# Altium project Remote_control.PrjPcb
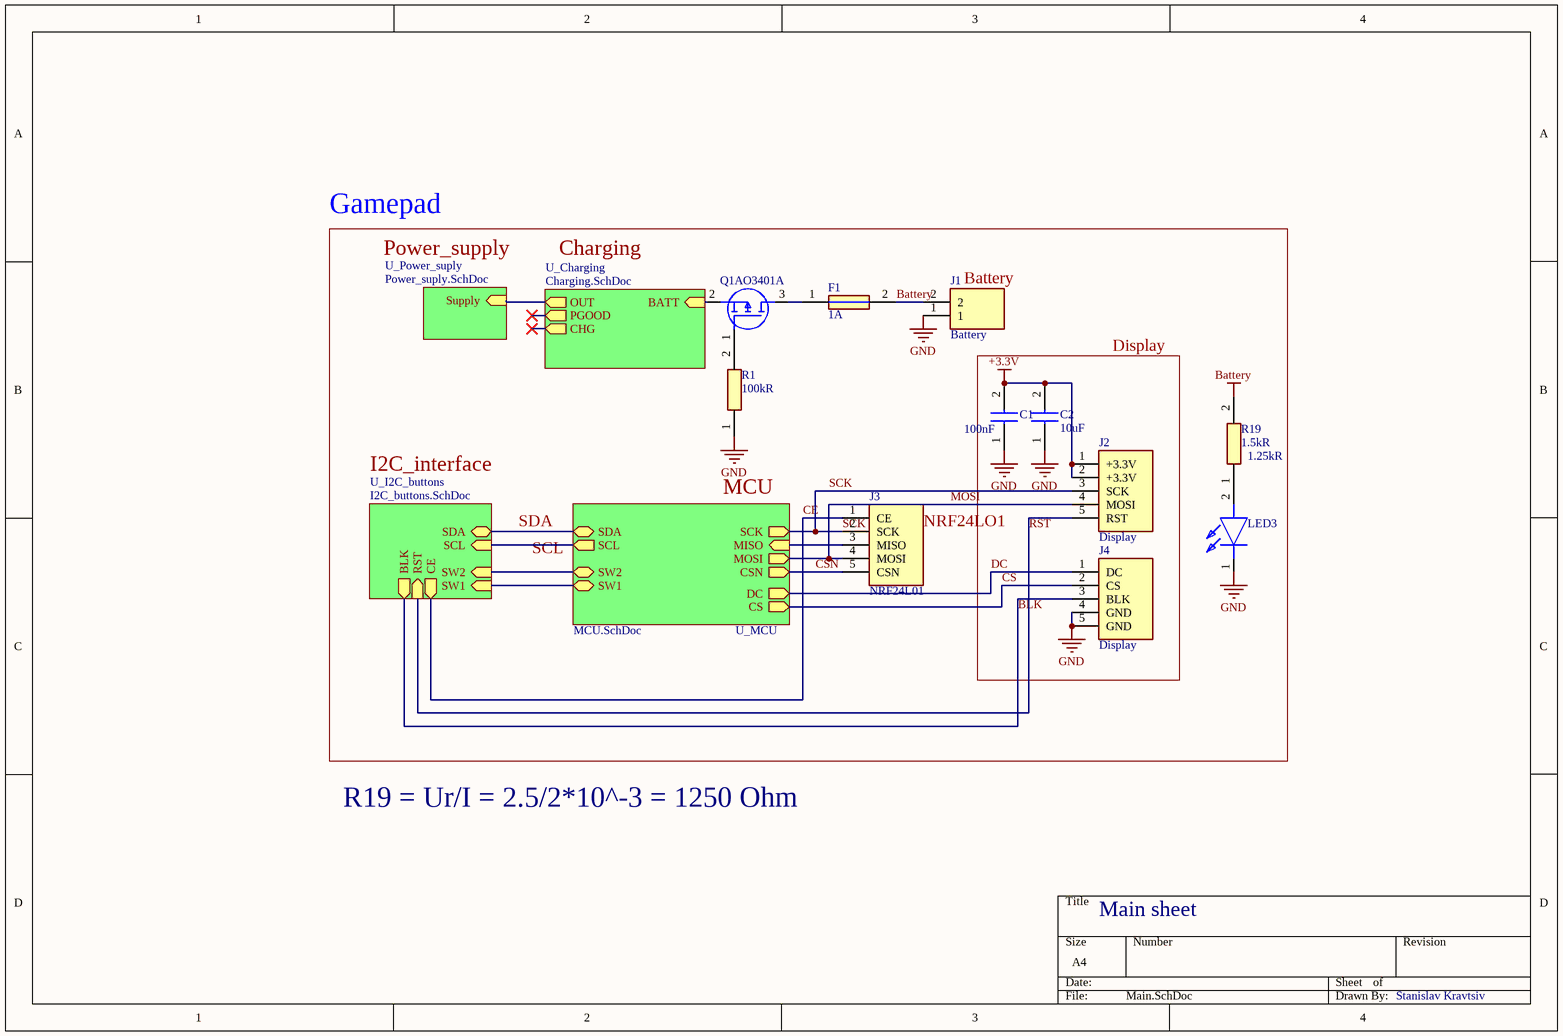
[diagram p0: Main.SchDoc]
5 sheets, 50 parts. Net scope: hierarchical (ports join the sheet entries above them; power ports are global).
Board file: Remote_control_PCB.PcbDoc
Sheets:
  Main.SchDoc
    U_MCU = MCU.SchDoc
    U_I2C_buttons = I2C_buttons.SchDoc
    U_Power_suply = Power_suply.SchDoc
    U_Charging = Charging.SchDoc

## Sheet Main.SchDoc
size A4; SheetNumber: 2; SheetTotal: 6

### Parts
C1  100nF  [CAPC1608X95N]
C2  10uF  [CAPC2012X140N]
F1  1А  [FUSC6125X279N]
J1  Battery  [Conector_2]
J2  Display  [1.25_JSH-GH_5]
J3  NRF24L01  [1.25_JSH-GH_5]
J4  Display  [1.25_JSH-GH_5]
LED3  LS_L29K-H1J2-1  [SMT-0603]  (value not drawn)
Q1  AO3401A  [SOT95P280X125-3N]
R1  100kR  [RESC1608X55N]
R19  1.5kR  [RESC1608X55N]

### Blocks framed on the sheet
Gamepad: F1 J1 J3 LED3 Q1 R1 R19
Display: C1 C2 J2 J4

### Sub-sheets
U_Charging = Charging.SchDoc: BATT (in), OUT (out), PGOOD (out), CHG (out)
U_I2C_buttons = I2C_buttons.SchDoc: CE (out), RST (in), BLK (out), SDA (bidir), SCL (in), SW2 (in), SW1 (in)
U_MCU = MCU.SchDoc: DC (out), CS (out), SDA (bidir), SCL (out), SW2 (bidir), SW1 (bidir), CSN (out), MOSI (out), MISO (in), SCK (out)
U_Power_suply = Power_suply.SchDoc: Supply (in)

### Nets
+3.3V: C1.2 C2.2 J2.1(+3.3V) J2.2(+3.3V)
Battery: F1.2 J1.2 R19.2
GND: C1.1 C2.1 J1.1 J4.4(GND) J4.5(GND) LED3.1(K) R1.1
BATT: Q1.2(S) ; sheet U_Charging/BATT
BLK: J4.3(BLK) ; sheet U_I2C_buttons/BLK
CE: J3.1(CE) ; sheet U_I2C_buttons/CE
CS: J4.2(CS) ; sheet U_MCU/CS
CSN: J3.5(CSN) ; sheet U_MCU/CSN
DC: J4.1(DC) ; sheet U_MCU/DC
MISO: J3.3(MISO) ; sheet U_MCU/MISO
MOSI: J2.4(MOSI) J3.4(MOSI) ; sheet U_MCU/MOSI
OUT: sheet U_Power_suply/Supply, sheet U_Charging/OUT, sheet U_Charging/PGOOD, sheet U_Charging/CHG
RST: J2.5(RST) ; sheet U_I2C_buttons/RST
SCK: J2.3(SCK) J3.2(SCK) ; sheet U_MCU/SCK
SCL: sheet U_MCU/SCL, sheet U_I2C_buttons/SCL
SDA: sheet U_MCU/SDA, sheet U_I2C_buttons/SDA
SW1: sheet U_MCU/SW1, sheet U_I2C_buttons/SW1
SW2: sheet U_MCU/SW2, sheet U_I2C_buttons/SW2
NetF1_1: F1.1 Q1.3(D)
NetLED3_2: LED3.2(A) R19.1
NetQ1_1: Q1.1(G) R1.2

### Notes on the sheet
- Power_supply
- Charging
- (near J1) Battery
- I2C_interface
- MCU
- (near R19) 1.25kR
- SDA
- SCL
- NRF24LO1
- R19 = Ur/I = 2.5/2*10^-3 = 1250 Ohm
- Main sheet
- Stanislav Kravtsiv

### Library data of the parts
C1 = 0603B104K500CT: Capacitor; Manufacturer_Name: Walsin Technology Corporation; Datasheet Link: https://datasheet.datasheetarchive.com/originals/distributors/DKDS41/DSANUWW0027552.pdf; Height: 0.95mm; Manufacturer_Part_Number: 0603B104K500CT; Mouser Part Number: 791-0603B104K500CT; Mouser Price/Stock: https://www.mouser.co.uk/ProductDetail/Walsin/0603B104K500CT?qs=fIkAfuXiAQLxgNQoxkAdgw%3D%3D; Arrow Part Number: 0603B104K500CT; Arrow Price/Stock: https://www.arrow.com/en/products/0603b104k500ct/walsin-technology
C2 = CL21B106KPQNNNG: Capacitor; Manufacturer_Name: SAMSUNG; Datasheet Link: https://datasheet.datasheetarchive.com/originals/distributors/Datasheets-DGA8/2485630.pdf; Height: 1.4mm; Manufacturer_Part_Number: CL21B106KPQNNNG; Mouser Part Number: 187-CL21B106KPQNNNG; Mouser Price/Stock: https://www.mouser.co.uk/ProductDetail/Samsung-Electro-Mechanics/CL21B106KPQNNNG?qs=yOVawPpwOwmi1gAJqK4H6Q%3D%3D; Arrow Part Number: CL21B106KPQNNNG; Arrow Price/Stock: https://www.arrow.com/en/products/cl21b106kpqnnng/samsung-electro-mechanics?utm_currency=USD&region=nac
F1 = 0679L2000-01: Fuse; Manufacturer_Name: BelFuse; Datasheet Link: https://componentsearchengine.com/Datasheets/1/0679L2000-01.pdf; Height: 2.79mm; Manufacturer_Part_Number: 0679L2000-01; Mouser Part Number: 530-0679L2000-01; Mouser Price/Stock: https://www.mouser.co.uk/ProductDetail/Bel-Fuse/0679L2000-01?qs=ZqXcJfGlKsicXrgxMSU%252B%2Fw%3D%3D
J1 = B2B-XH-AM_LF__SN_: Connector; Manufacturer_Name: JST (JAPAN SOLDERLESS TERMINALS); Manufacturer_Part_Number: B2B-XH-AM(LF)(SN); Datasheet Link: https://www.jst-mfg.com/product/pdf/eng/eXH.pdf; Height: 7mm; Mouser Part Number: 306-B2B-XH-AMLFSNP; Mouser Price/Stock: https://www.mouser.co.uk/ProductDetail/JST-Commercial/B2B-XH-AMLFSN?qs=cdbOS8ANM9BJgHgwB7WxQw%3D%3D; Arrow Part Number: B2B-XH-AM(LF)(SN); Arrow Price/Stock: https://www.arrow.com/en/products/b2b-xh-am-lf-sn/jst-manufacturing?utm_currency=USD&region=europe
J2-J4 = B5B-XH-AM__LF__SN_: Connector; Manufacturer_Name: JST (JAPAN SOLDERLESS TERMINALS); Manufacturer_Part_Number: B5B-XH-AM (LF)(SN); Datasheet Link: http://uk.rs-online.com/web/p/products/1755317; Height: 7mm; Arrow Part Number: B5B-XH-AM (LF)(SN); Arrow Price/Stock: https://www.arrow.com/en/products/b5b-xh-am-lf-sn/jst-manufacturing
LED3 = LS_L29K-H1J2-1: LED; Manufacturer_Name: ams OSRAM; Manufacturer_Part_Number: LS L29K-H1J2-1; Mouser Part Number: 720-LSL29K-H1J2-1-Z; Mouser Price/Stock: https://www.mouser.com/Search/Refine.aspx?Keyword=720-LSL29K-H1J2-1-Z
Q1 = AO3401A: MOSFET (P-Channel); Manufacturer_Name: Alpha & Omega Semiconductors; Datasheet Link: http://www.aosmd.com/pdfs/datasheet/AO3401A.pdf; Height: 1.25mm; Manufacturer_Part_Number: AO3401A; Arrow Part Number: AO3401A; Arrow Price/Stock: https://www.arrow.com/en/products/ao3401a/alpha-and-omega-semiconductor.html?utm_currency=USD&region=europe
R1 = RC0603FR-07100KL: Resistor; Manufacturer_Name: YAGEO; Datasheet Link: https://www.yageo.com/upload/media/product/productsearch/datasheet/rchip/PYu-RC_Group_51_RoHS_L_12.pdf; Height: 0.55mm; Manufacturer_Part_Number: RC0603FR-07100KL; Mouser Part Number: 603-RC0603FR-07100KL; Mouser Price/Stock: https://www.mouser.co.uk/ProductDetail/YAGEO/RC0603FR-07100KL?qs=e1ok2LiJcmaihem8Va5%2Fsw%3D%3D; Arrow Part Number: RC0603FR-07100KL; Arrow Price/Stock: https://www.arrow.com/en/products/rc0603fr-07100kl/yageo?utm_currency=USD&region=europe
R19 = RC0603FR-071K5L: Resistor; Manufacturer_Name: Yageo Group; Datasheet Link: https://www.yageo.com/upload/media/product/productsearch/datasheet/rchip/PYu-RC_Group_51_RoHS_L_12.pdf; Height: 0.55mm; Manufacturer_Part_Number: RC0603FR-071K5L; Mouser Part Number: 603-RC0603FR-071K5L; Mouser Price/Stock: https://www.mouser.co.uk/ProductDetail/YAGEO/RC0603FR-071K5L?qs=VU8sRB4EgwBMt9nc4XGNgA%3D%3D; Arrow Part Number: RC0603FR-071K5L; Arrow Price/Stock: https://www.arrow.com/en/products/rc0603fr-071k5l/yageo?utm_currency=USD&region=europe

## Sheet MCU.SchDoc
size A4; SheetNumber: 4; SheetTotal: 6
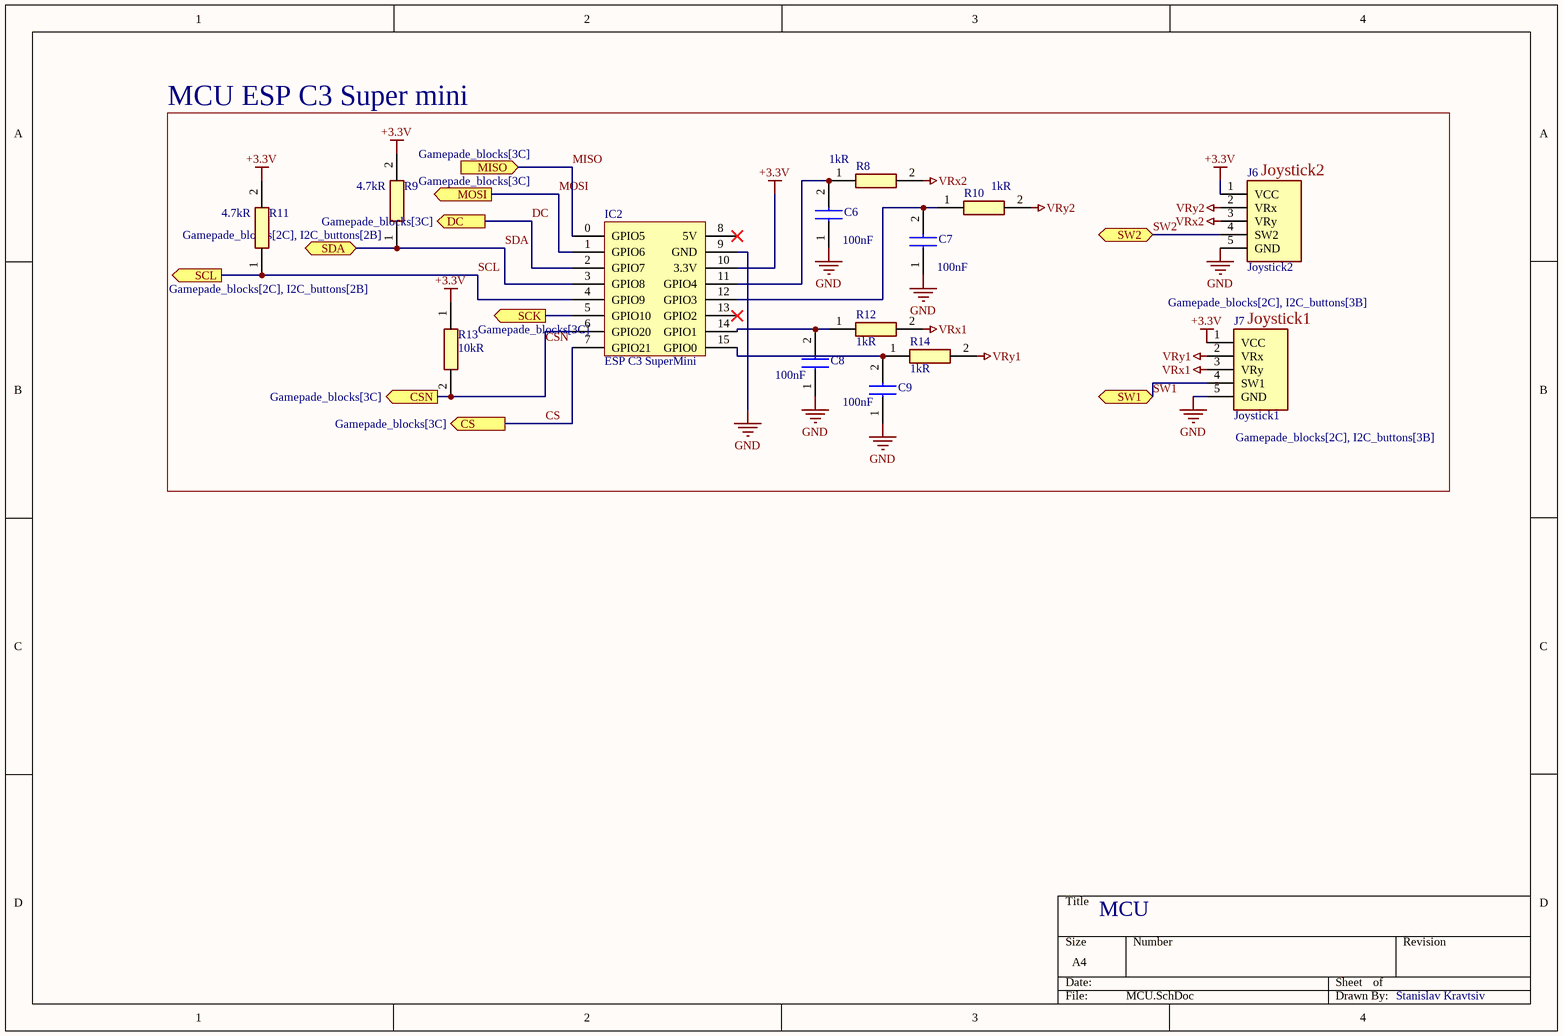
[diagram p1: MCU.SchDoc]

### Parts
C6  100nF  [CAPC1608X95N]
C7  100nF  [CAPC1608X95N]
C8  100nF  [CAPC1608X95N]
C9  100nF  [CAPC1608X95N]
IC2  ESP C3 SuperMini  [esp c3 super mini]
J6  Joystick2  [1.25_JSH-GH_5]
J7  Joystick1  [1.25_JSH-GH_5]
R8  1kR  [RESC1608X55N]
R9  4.7kR  [RESC1608X55N]
R10  1kR  [RESC1608X55N]
R11  4.7kR  [RESC1608X55N]
R12  1kR  [RESC1608X55N]
R13  10kR  [RESC1608X55N]
R14  1kR  [RESC1608X55N]

### Ports
CS (out, see Gamepade_blocks[3C]), CSN (out, see Gamepade_blocks[3C]), DC (out, see Gamepade_blocks[3C]), MISO (in, see Gamepade_blocks[3C]), MOSI (out, see Gamepade_blocks[3C]), SCK (out, see Gamepade_blocks[3C]), SCL (out, see Gamepade_blocks[2C], I2C_buttons[2B]), SDA (bidir, see Gamepade_blocks[2C], I2C_buttons[2B]), SW1 (bidir, see Gamepade_blocks[2C], I2C_buttons[3B]), SW2 (bidir, see Gamepade_blocks[2C], I2C_buttons[3B])

### Nets
+3.3V: IC2.10(3.3V) J6.1(VCC) J7.1(VCC) R9.2 R11.2 R13.1
GND: C6.1 C7.1 C8.1 C9.1 IC2.9(GND) J6.5(GND) J7.5(GND)
VRx1: J7.3(VRy) R12.2
VRx2: J6.3(VRy) R8.2
VRy1: J7.2(VRx) R14.2
VRy2: J6.2(VRx) R10.2
CS: IC2.7(GPIO21) ; port CS
CSN: IC2.6(GPIO20) R13.2 ; port CSN
DC: IC2.2(GPIO7) ; port DC
MISO: IC2.0(GPIO5) ; port MISO
MOSI: IC2.1(GPIO6) ; port MOSI
SCK: IC2.5(GPIO10) ; port SCK
SCL: IC2.4(GPIO9) R11.1 ; port SCL
SDA: IC2.3(GPIO8) R9.1 ; port SDA
SW1: J7.4(SW1) ; port SW1
SW2: J6.4(SW2) ; port SW2
NetC6_2: C6.2 IC2.11(GPIO4) R8.1
NetC7_2: C7.2 IC2.12(GPIO3) R10.1
NetC8_2: C8.2 IC2.14(GPIO1) R12.1
NetC9_2: C9.2 IC2.15(GPIO0) R14.1

Not connected (* = marked no-connect by the designer): IC2 8(5V)* 13(GPIO2)*

### Notes on the sheet
- MCU ESP C3 Super mini
- (near J6) Joystick2
- (near J7) Joystick1
- MCU
- Stanislav Kravtsiv

### Library data of the parts
C6-C9 = 0603B104K500CT: as C1 on sheet Main; Datasheet Link: https://datasheet.datasheetarchive.com/originals/distributors/DKDS41/DSANUWW0027552.pdf; Height: 0.95mm; Manufacturer_Part_Number: 0603B104K500CT; Mouser Part Number: 791-0603B104K500CT; Mouser Price/Stock: https://www.mouser.co.uk/ProductDetail/Walsin/0603B104K500CT?qs=fIkAfuXiAQLxgNQoxkAdgw%3D%3D; Arrow Part Number: 0603B104K500CT; Arrow Price/Stock: https://www.arrow.com/en/products/0603b104k500ct/walsin-technology
IC2 = IC
J6 J7 = B5B-XH-AM__LF__SN_: as J2 on sheet Main; Datasheet Link: http://uk.rs-online.com/web/p/products/1755317; Height: 7mm; Arrow Part Number: B5B-XH-AM (LF)(SN); Arrow Price/Stock: https://www.arrow.com/en/products/b5b-xh-am-lf-sn/jst-manufacturing
R8 R10 R12 R14 = RC0603FR-071KL: Resistor; Manufacturer_Name: Yageo Group; Datasheet Link: https://www.yageo.com/upload/media/product/productsearch/datasheet/rchip/PYu-RC_Group_51_RoHS_L_12.pdf; Height: 0.55mm; Manufacturer_Part_Number: RC0603FR-071KL; Mouser Part Number: 603-RC0603FR-071KL; Mouser Price/Stock: https://www.mouser.co.uk/ProductDetail/YAGEO/RC0603FR-071KL?qs=VU8sRB4EgwApHsk4rF%2F3zg%3D%3D; Arrow Part Number: RC0603FR-071KL; Arrow Price/Stock: https://www.arrow.com/en/products/rc0603fr-071kl/yageo?utm_currency=USD&region=europe
R9 R11 = RC0603FR-074K75L: Resistor; Manufacturer_Name: Yageo Group; Datasheet Link: http://www.yageo.com/documents/recent/PYu-RC0603_51_RoHS_L_v5.pdf; Height: 0.55mm; Manufacturer_Part_Number: RC0603FR-074K75L; Mouser Part Number: 603-RC0603FR-074K75L; Mouser Price/Stock: https://www.mouser.co.uk/ProductDetail/Yageo/RC0603FR-074K75L?qs=5Z1f76oN9PMSImX%2FXUaE6Q%3D%3D; Arrow Part Number: RC0603FR-074K75L; Arrow Price/Stock: https://www.arrow.com/en/products/rc0603fr-074k75l/yageo
R13 = RC0603FR0710KL: Resistor; Manufacturer_Name: Yageo Group; Value: 10kOhm; Datasheet Link: http://www.yageo.com/documents/recent/PYu-RC0603_51_RoHS_L_v5.pdf; Height: 0.55mm; Manufacturer_Part_Number: RC0603FR0710KL; Arrow Part Number: RC0603FR0710KL; Arrow Price/Stock: https://www.arrow.com/en/products/rc0603fr-0710kl/yageo

## Sheet I2C_buttons.SchDoc
size A4; SheetNumber: 6; SheetTotal: 6
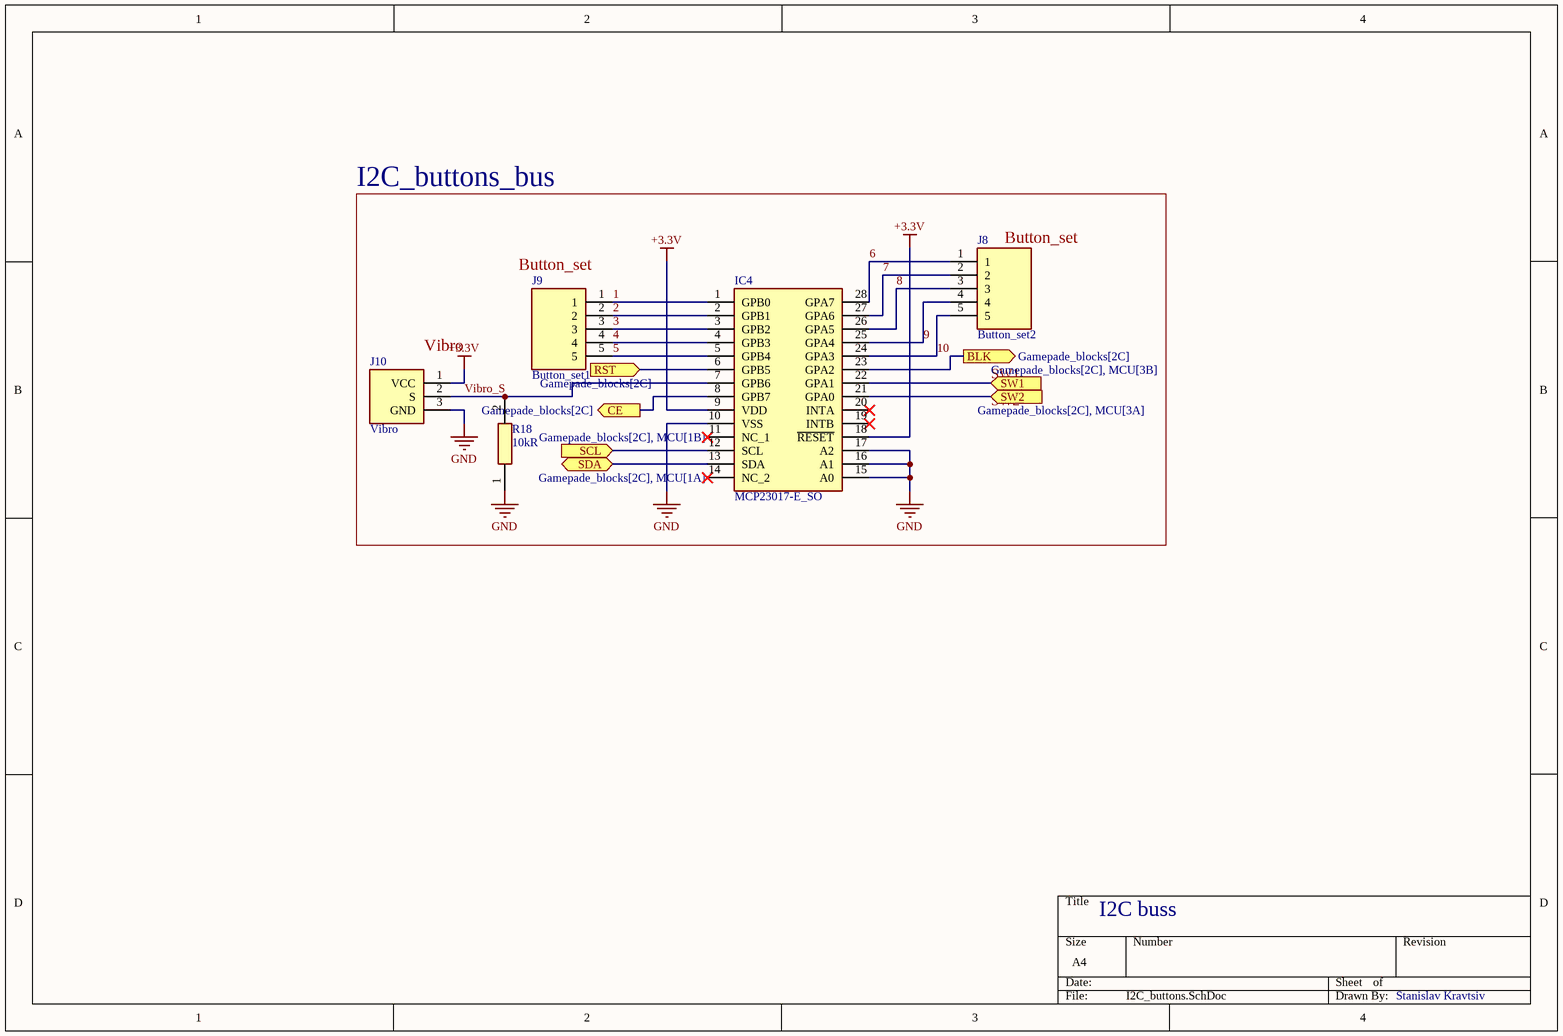
[diagram p2: I2C_buttons.SchDoc]

### Parts
IC4  MCP23017-E_SO  [SOIC127P1030X265-28N]
J8  Button_set2  [1.25_JSH-GH_5]
J9  Button_set1  [1.25_JSH-GH_5]
J10  Vibro  [B3BXHALFSN]
R18  10kR  [RESC1608X55N]

### Ports
BLK (out, see Gamepade_blocks[2C]), CE (out, see Gamepade_blocks[2C]), RST (in, see Gamepade_blocks[2C]), SCL (in, see Gamepade_blocks[2C], MCU[1B]), SDA (bidir, see Gamepade_blocks[2C], MCU[1A]), SW1 (in, see Gamepade_blocks[2C], MCU[3B]), SW2 (in, see Gamepade_blocks[2C], MCU[3A])

### Nets
+3.3V: IC4.9(VDD) IC4.18(~{RESET}) J10.1(VCC)
GND: IC4.10(VSS) IC4.15(A0) IC4.16(A1) IC4.17(A2) J10.3(GND) R18.1
1: IC4.1(GPB0) J9.1
2: IC4.2(GPB1) J9.2
3: IC4.3(GPB2) J9.3
4: IC4.4(GPB3) J9.4
5: IC4.5(GPB4) J9.5
6: IC4.28(GPA7) J8.1
7: IC4.27(GPA6) J8.2
8: IC4.26(GPA5) J8.3
9: IC4.25(GPA4) J8.4
10: IC4.24(GPA3) J8.5
BLK: IC4.23(GPA2) ; port BLK
CE: IC4.8(GPB7) ; port CE
RST: IC4.6(GPB5) ; port RST
SCL: IC4.12(SCL) ; port SCL
SDA: IC4.13(SDA) ; port SDA
SW1: IC4.22(GPA1) ; port SW1
SW2: IC4.21(GPA0) ; port SW2
Vibro_S: IC4.7(GPB6) J10.2(S) R18.2

Not connected (* = marked no-connect by the designer): IC4 11(NC_1)* 14(NC_2)* 19(INTB)* 20(INTA)*

### Notes on the sheet
- I2C_buttons_bus
- (near J8) Button_set
- (near J9) Button_set
- (near J10) Vibro
- (near J8) SW1
- SW2
- I2C buss
- Stanislav Kravtsiv

### Library data of the parts
IC4 = MCP23017-E_SO: Integrated Circuit; Manufacturer_Name: Microchip; Manufacturer_Part_Number: MCP23017-E/SO; Datasheet Link: https://datasheet.datasheetarchive.com/originals/distributors/SFDatasheet-4/sf-00090057.pdf; Height: 2.65mm; Mouser Part Number: 579-MCP23017-E/SO; Mouser Price/Stock: https://www.mouser.co.uk/ProductDetail/Microchip-Technology/MCP23017-E-SO?qs=usxtMOJb1Rz8hft7vV7YMQ%3D%3D; Arrow Part Number: MCP23017-E/SO; Arrow Price/Stock: https://www.arrow.com/en/products/mcp23017-eso/microchip-technology.html?utm_currency=USD&region=europe
J8 J9 = B5B-XH-AM__LF__SN_: as J2 on sheet Main; Datasheet Link: http://uk.rs-online.com/web/p/products/1755317; Height: 7mm; Arrow Part Number: B5B-XH-AM (LF)(SN); Arrow Price/Stock: https://www.arrow.com/en/products/b5b-xh-am-lf-sn/jst-manufacturing
J10 = B3B-XH-A_LF__SN_: Connector; Manufacturer_Name: JST (JAPAN SOLDERLESS TERMINALS); Manufacturer_Part_Number: B3B-XH-A(LF)(SN); Datasheet Link: https://datasheet.lcsc.com/szlcsc/1812131720_JST-Sales-America-B3B-XH-A-LF-SN_C144394.pdf; Height: 7mm; Mouser Part Number: 306-B3BXHALFSNP; Mouser Price/Stock: https://www.mouser.co.uk/ProductDetail/JST-Commercial/B3B-XH-ALFSN?qs=cdbOS8ANM9BVkoboCCIEMQ%3D%3D; Arrow Part Number: B3B-XH-A(LF)(SN); Arrow Price/Stock: https://www.arrow.com/en/products/b3b-xh-a-lf-sn/jst-manufacturing.html?utm_currency=USD&region=europe
R18 = RC0603FR0710KL: as R13 on sheet MCU; Datasheet Link: http://www.yageo.com/documents/recent/PYu-RC0603_51_RoHS_L_v5.pdf; Height: 0.55mm; Manufacturer_Part_Number: RC0603FR0710KL; Arrow Part Number: RC0603FR0710KL; Arrow Price/Stock: https://www.arrow.com/en/products/rc0603fr-0710kl/yageo

## Sheet Power_suply.SchDoc
size A4; SheetNumber: 5; SheetTotal: 6
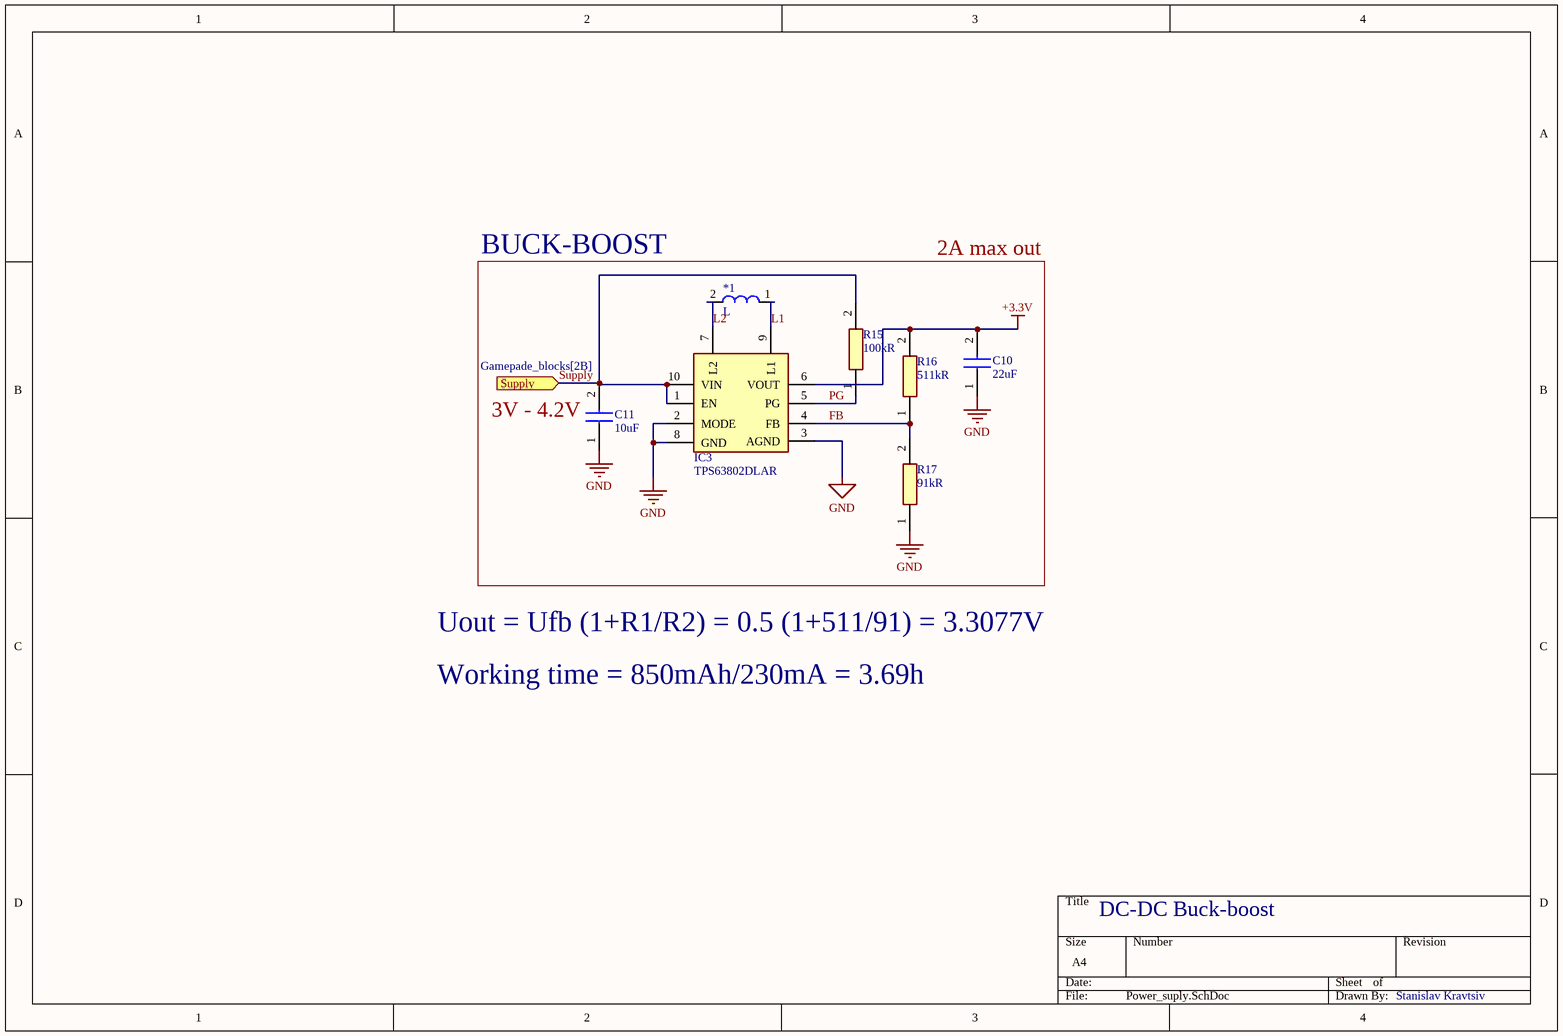
[diagram p3: Power_suply.SchDoc]

### Parts
*1  L  [Coil]
C10  22uF  [ZRB18x]
C11  10uF  [CAPC2012X140N]
IC3  TPS63802DLAR  [TPS63802DLAR]
R15  100kR  [RESC1608X55N]
R16  511kR  [RESC1608X55N]
R17  91kR  [RESC1608X55N]

### Ports
Supply (in, see Gamepade_blocks[2B])

### Nets
+3.3V: C10.2 IC3.6(VOUT) R16.2
GND: C10.1 C11.1 IC3.2(MODE) IC3.3(AGND) IC3.8(GND) R17.1
FB: IC3.4(FB) R16.1 R17.2
L1: *1.1 IC3.9(L1)
L2: *1.2 IC3.7(L2)
PG: IC3.5(PG) R15.1
Supply: C11.2 IC3.1(EN) IC3.10(VIN) R15.2 ; port Supply  [project net OUT]

### Notes on the sheet
- BUCK-BOOST
- 2A max out
- (near C11) 3V - 4.2V
- Uout = Ufb (1+R1/R2) = 0.5 (1+511/91) = 3.3077V
- Working time = 850mAh/230mA = 3.69h
- DC-DC Buck-boost
- Stanislav Kravtsiv

### Library data of the parts
C10 = ZRB18AR61A226ME01L: Capacitor; Manufacturer_Name: Murata Electronics; Datasheet Link: https://search.murata.co.jp/Ceramy/image/img/A01X/G101/ENG/ZRB18AR61A226ME01-03A.pdf; Height: 1.2mm; Manufacturer_Part_Number: ZRB18AR61A226ME01L; Mouser Part Number: 81-ZRB18AR61A226ME1L; Mouser Price/Stock: https://www.mouser.co.uk/ProductDetail/Murata-Electronics/ZRB18AR61A226ME01L?qs=5aG0NVq1C4zcCU98as8CPQ%3D%3D; Arrow Part Number: ZRB18AR61A226ME01L; Arrow Price/Stock: https://www.arrow.com/en/products/zrb18ar61a226me01l/murata-manufacturing?region=nac
C11 = CL21B106KPQNNNG: Capacitor; Manufacturer_Name: SAMSUNG; Datasheet Link: https://datasheet.datasheetarchive.com/originals/distributors/Datasheets-DGA8/2485630.pdf; Height: 1.4mm; Manufacturer_Part_Number: CL21B106KPQNNNG; Mouser Part Number: 187-CL21B106KPQNNNG; Mouser Price/Stock: https://www.mouser.co.uk/ProductDetail/Samsung-Electro-Mechanics/CL21B106KPQNNNG?qs=yOVawPpwOwmi1gAJqK4H6Q%3D%3D; Arrow Part Number: CL21B106KPQNNNG; Arrow Price/Stock: https://www.arrow.com/en/products/cl21b106kpqnnng/samsung-electro-mechanics?utm_currency=USD&region=nac
IC3 = TPS63802DLAR: Integrated Circuit; Manufacturer_Name: Texas Instruments; Datasheet Link: http://www.ti.com/lit/ds/symlink/tps63802.pdf; Height: 1mm; Manufacturer_Part_Number: TPS63802DLAR; Mouser Part Number: 595-TPS63802DLAR; Mouser Price/Stock: https://www.mouser.co.uk/ProductDetail/Texas-Instruments/TPS63802DLAR?qs=9r4v7xj2Lnmr2ylyTiX9Mg%3D%3D; Arrow Part Number: TPS63802DLAR; Arrow Price/Stock: https://www.arrow.com/en/products/tps63802dlar/texas-instruments?utm_currency=USD&region=nac
R15 = RC0603FR-07100KL: Resistor; Manufacturer_Name: YAGEO; Datasheet Link: https://www.yageo.com/upload/media/product/productsearch/datasheet/rchip/PYu-RC_Group_51_RoHS_L_12.pdf; Height: 0.55mm; Manufacturer_Part_Number: RC0603FR-07100KL; Mouser Part Number: 603-RC0603FR-07100KL; Mouser Price/Stock: https://www.mouser.co.uk/ProductDetail/YAGEO/RC0603FR-07100KL?qs=e1ok2LiJcmaihem8Va5%2Fsw%3D%3D; Arrow Part Number: RC0603FR-07100KL; Arrow Price/Stock: https://www.arrow.com/en/products/rc0603fr-07100kl/yageo?utm_currency=USD&region=europe
R16 = ERJ-3EKF5113V: Resistor; Manufacturer_Name: Panasonic; Datasheet Link: http://industrial.panasonic.com/cdbs/www-data/pdf/RDA0000/AOA0000C86.pdf; Height: 0.55mm; Manufacturer_Part_Number: ERJ-3EKF5113V; Mouser Part Number: 667-ERJ-3EKF5113V; Mouser Price/Stock: https://www.mouser.co.uk/ProductDetail/Panasonic/ERJ-3EKF5113V?qs=MVjVSMjNRMp7W4j9eXihvA%3D%3D
R17 = ERJ-3EKF9102V: Resistor; Manufacturer_Name: Panasonic; Datasheet Link: http://industrial.panasonic.com/cdbs/www-data/pdf/RDA0000/AOA0000C86.pdf; Height: 0.55mm; Manufacturer_Part_Number: ERJ-3EKF9102V; Mouser Part Number: 667-ERJ-3EKF9102V; Mouser Price/Stock: https://www.mouser.co.uk/ProductDetail/Panasonic/ERJ-3EKF9102V?qs=iBwFsHVUAOc4tH39HZ1qJA%3D%3D; Arrow Part Number: ERJ-3EKF9102V; Arrow Price/Stock: https://www.arrow.com/en/products/erj-3ekf9102v/panasonic?region=nac

## Sheet Charging.SchDoc
size A4; SheetNumber: 3; SheetTotal: 6
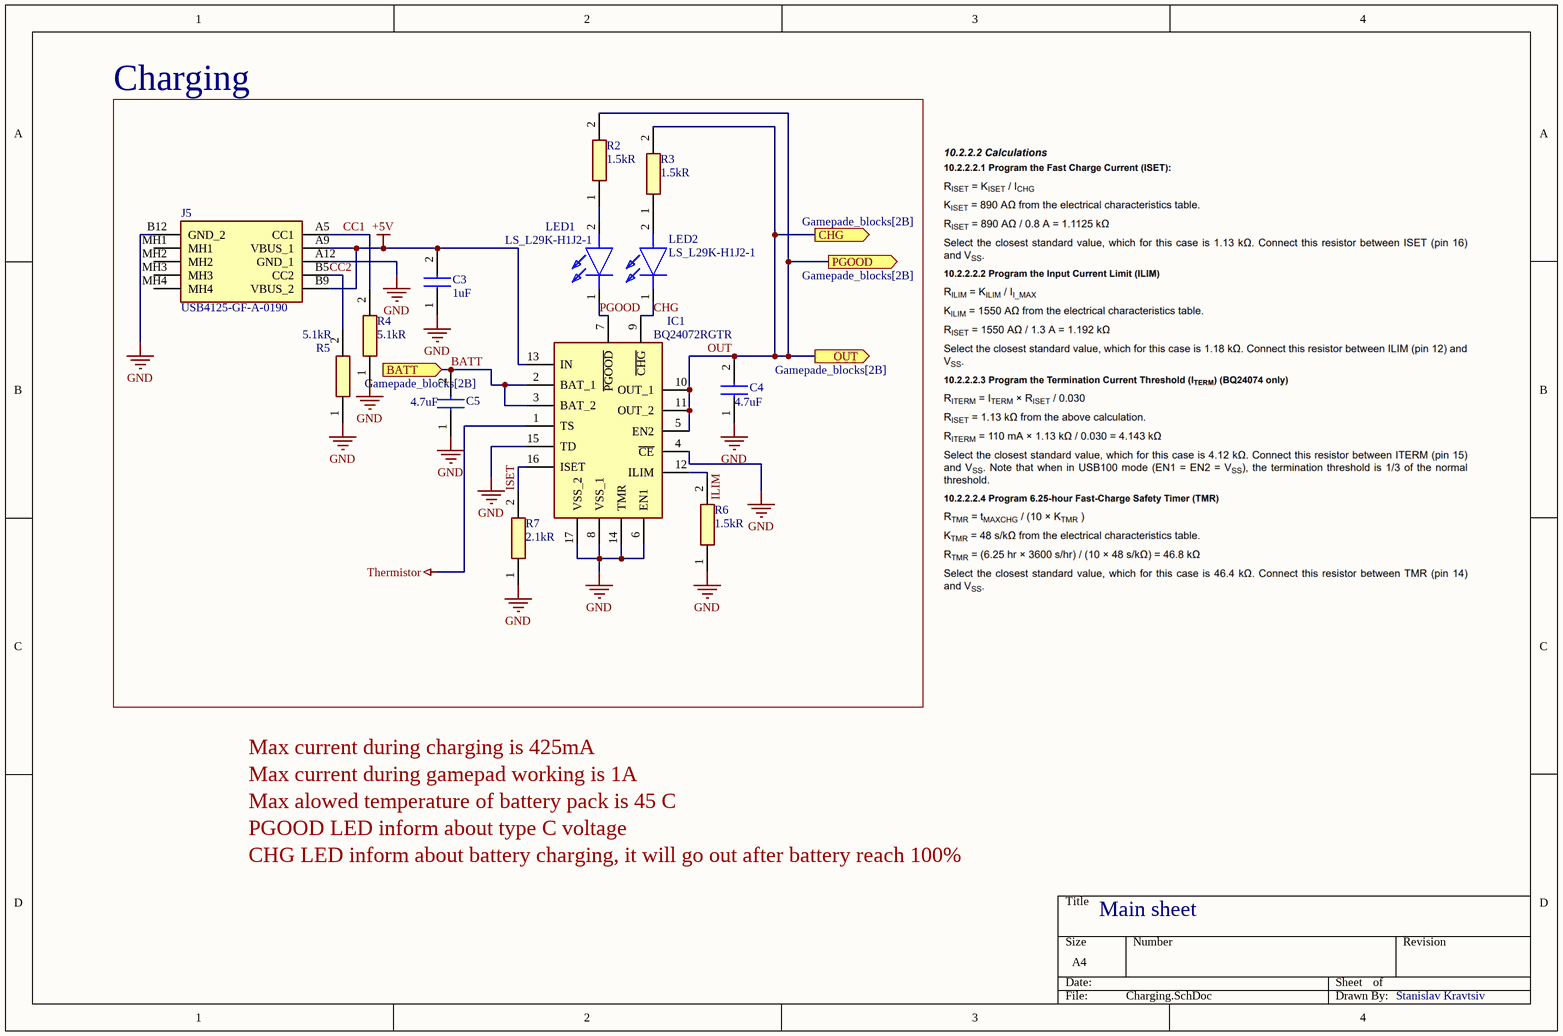
[diagram p4: Charging.SchDoc]

### Parts
C3  1uF  [C0805]
C4  4.7uF  [CAPC1608X90N]
C5  4.7uF  [CAPC1608X90N]
IC1  BQ24072RGTR  [QFN50P300X300X100-17N-D]
J5  USB4125-GF-A-0190  [USB4125GFA0190]
LED1  LS_L29K-H1J2-1  [SMT-0603]
LED2  LS_L29K-H1J2-1  [SMT-0603]
R2  1.5kR  [RESC1608X55N]
R3  1.5kR  [RESC1608X55N]
R4  5.1kR  [RESC1608X60N]
R5  5.1kR  [RESC1608X60N]
R6  1.5kR  [RESC1608X55N]
R7  2.1kR  [RESC1608X55N]

### Blocks framed on the sheet
Charging: C3-C5 IC1 J5 LED1 LED2 R2-R7

### Ports
BATT (in, see Gamepade_blocks[2B]), CHG (out, see Gamepade_blocks[2B]), OUT (out, see Gamepade_blocks[2B]), PGOOD (out, see Gamepade_blocks[2B])

### Nets
+5V: C3.2 IC1.13(IN) J5.A9(VBUS_1) J5.B9(VBUS_2)
GND: C3.1 C4.1 C5.1 IC1.4(~{CE}) IC1.6(EN1) IC1.8(VSS_1) IC1.14(TMR) IC1.15(TD) IC1.17(VSS_2) J5.A12(GND_1) J5.B12(GND_2) R4.1 R5.1 R6.1 R7.1
Thermistor: IC1.1(TS)
BATT: C5.2 IC1.2(BAT_1) IC1.3(BAT_2) ; port BATT
CC1: J5.A5(CC1) R4.2
CC2: J5.B5(CC2) R5.2
CHG: IC1.9(~{CHG}) LED2.1(K)
ILIM: IC1.12(ILIM) R6.2
ISET: IC1.16(ISET) R7.2
OUT: C4.2 IC1.5(EN2) IC1.10(OUT_1) IC1.11(OUT_2) R2.2 R3.2 ; port OUT, port PGOOD, port CHG
PGOOD: IC1.7(~{PGOOD}) LED1.1(K)
NetLED1_2: LED1.2(A) R2.1
NetLED2_2: LED2.2(A) R3.1

Not connected (* = marked no-connect by the designer): J5 MH1 MH2 MH3 MH4

### Notes on the sheet
- Max current during charging is 425mA
- Max current during gamepad working is 1A
- Max alowed temperature of battery pack is 45 C
- PGOOD LED inform about type C voltage
- CHG LED inform about battery charging, it will go out after battery reach 100%
- Main sheet
- Stanislav Kravtsiv

### Library data of the parts
C3 = 1uF: Capacitor; Manufacturer_Name: Yageo Group; Manufacturer_Part_Number: C0805C105K5RACTU; Datasheet Link: https://www.yageogroup.com/content/datasheet/asset/file/KEM_C1002_X7R_SMD; Height: 1.1mm; Mouser Part Number: 80-C0805C105K5R; Mouser Price/Stock: https://www.mouser.co.uk/ProductDetail/KEMET/C0805C105K5RACTU?qs=iP0bYSAMAFrBrUflcErrLQ%3D%3D; Arrow Part Number: C0805C105K5RACTU; Arrow Price/Stock: https://www.arrow.com/en/products/c0805c105k5ractu/kemet-corporation?region=nac
C4 C5 = CL10A475KP8NNNC: Capacitor; Manufacturer_Name: SAMSUNG; Datasheet Link: https://www.arrow.com/en/products/cl10a475kp8nnnc/samsung-electro-mechanics; Height: 0.9mm; Manufacturer_Part_Number: CL10A475KP8NNNC; Mouser Part Number: 187-CL10A475KP8NNNC; Mouser Price/Stock: https://www.mouser.co.uk/ProductDetail/Samsung-Electro-Mechanics/CL10A475KP8NNNC?qs=hqM3L16%252BxlfQRmkWsZz5vA%3D%3D; Arrow Part Number: CL10A475KP8NNNC; Arrow Price/Stock: https://www.arrow.com/en/products/cl10a475kp8nnnc/samsung-electro-mechanics?utm_currency=USD&region=nac
IC1 = BQ24072RGTR: Integrated Circuit; Manufacturer_Name: Texas Instruments; Datasheet Link: http://www.ti.com/lit/gpn/BQ24072; Height: 1mm; Manufacturer_Part_Number: BQ24072RGTR; Mouser Part Number: 595-BQ24072RGTR; Mouser Price/Stock: https://www.mouser.co.uk/ProductDetail/Texas-Instruments/BQ24072RGTR?qs=ZV%2Fxhq4oszo4knrw3goPOA%3D%3D; Arrow Part Number: BQ24072RGTR; Arrow Price/Stock: https://www.arrow.com/en/products/bq24072rgtr/texas-instruments.html?utm_currency=USD&region=nac
J5 = USB4125-GF-A-0190: Connector; Manufacturer_Name: GCT (GLOBAL CONNECTOR TECHNOLOGY); Datasheet Link: https://eu.mouser.com/datasheet/2/837/usb4125-2448699.pdf; Manufacturer_Part_Number: USB4125-GF-A-0190; Mouser Part Number: 640-USB4125-GF-A-190; Mouser Price/Stock: https://www.mouser.co.uk/ProductDetail/GCT/USB4125-GF-A-0190?qs=QNEnbhJQKvbCz4hEJBS24w%3D%3D
LED1 LED2 = LS_L29K-H1J2-1: as LED3 on sheet Main; Mouser Part Number: 720-LSL29K-H1J2-1-Z; Mouser Price/Stock: https://www.mouser.com/Search/Refine.aspx?Keyword=720-LSL29K-H1J2-1-Z
R2 R3 R6 = RC0603FR-071K5L: Resistor; Manufacturer_Name: Yageo Group; Datasheet Link: https://www.yageo.com/upload/media/product/productsearch/datasheet/rchip/PYu-RC_Group_51_RoHS_L_12.pdf; Height: 0.55mm; Manufacturer_Part_Number: RC0603FR-071K5L; Mouser Part Number: 603-RC0603FR-071K5L; Mouser Price/Stock: https://www.mouser.co.uk/ProductDetail/YAGEO/RC0603FR-071K5L?qs=VU8sRB4EgwBMt9nc4XGNgA%3D%3D; Arrow Part Number: RC0603FR-071K5L; Arrow Price/Stock: https://www.arrow.com/en/products/rc0603fr-071k5l/yageo?utm_currency=USD&region=europe
R4 R5 = WR06X5101FTL: Resistor; Manufacturer_Name: Walsin Technology Corporation; Datasheet Link: https://componentsearchengine.com/Datasheets/2/WR06X5101FTL.pdf; Height: 0.6mm; Manufacturer_Part_Number: WR06X5101FTL
R7 = RC0603FR-072K1L: Resistor; Manufacturer_Name: Yageo Group; Datasheet Link: https://www.yageo.com/upload/media/product/products/datasheet/rchip/PYu-RC_Group_51_RoHS_L_12.pdf; Height: 0.55mm; Manufacturer_Part_Number: RC0603FR-072K1L; Mouser Part Number: 603-RC0603FR-072K1L; Mouser Price/Stock: https://www.mouser.co.uk/ProductDetail/YAGEO/RC0603FR-072K1L?qs=IuGqVx9wL0IQ8qvrNmtVmg%3D%3D; Arrow Part Number: RC0603FR-072K1L; Arrow Price/Stock: https://www.arrow.com/en/products/rc0603fr-072k1l/yageo?utm_currency=USD&region=nac

## Nets that join several sheets
+3.3V: Main (C1.2 C2.2 J2.1 J2.2), MCU (6 pins), I2C_buttons (IC4.9 IC4.18 J10.1), Power_suply (C10.2 IC3.6 R16.2)
GND: Main (7 pins), MCU (7 pins), I2C_buttons (6 pins), Power_suply (6 pins), Charging (15 pins)
BATT: Main (Q1.2), Charging (C5.2 IC1.2 IC1.3)
BLK: Main (J4.3), I2C_buttons (IC4.23)
CE: Main (J3.1), I2C_buttons (IC4.8)
CS: Main (J4.2), MCU (IC2.7)
CSN: Main (J3.5), MCU (IC2.6 R13.2)
DC: Main (J4.1), MCU (IC2.2)
MISO: Main (J3.3), MCU (IC2.0)
MOSI: Main (J2.4 J3.4), MCU (IC2.1)
OUT: Power_suply (C11.2 IC3.1 IC3.10 R15.2), Charging (6 pins)
RST: Main (J2.5), I2C_buttons (IC4.6)
SCK: Main (J2.3 J3.2), MCU (IC2.5)
SCL: MCU (IC2.4 R11.1), I2C_buttons (IC4.12)
SDA: MCU (IC2.3 R9.1), I2C_buttons (IC4.13)
SW1: MCU (J7.4), I2C_buttons (IC4.22)
SW2: MCU (J6.4), I2C_buttons (IC4.21)